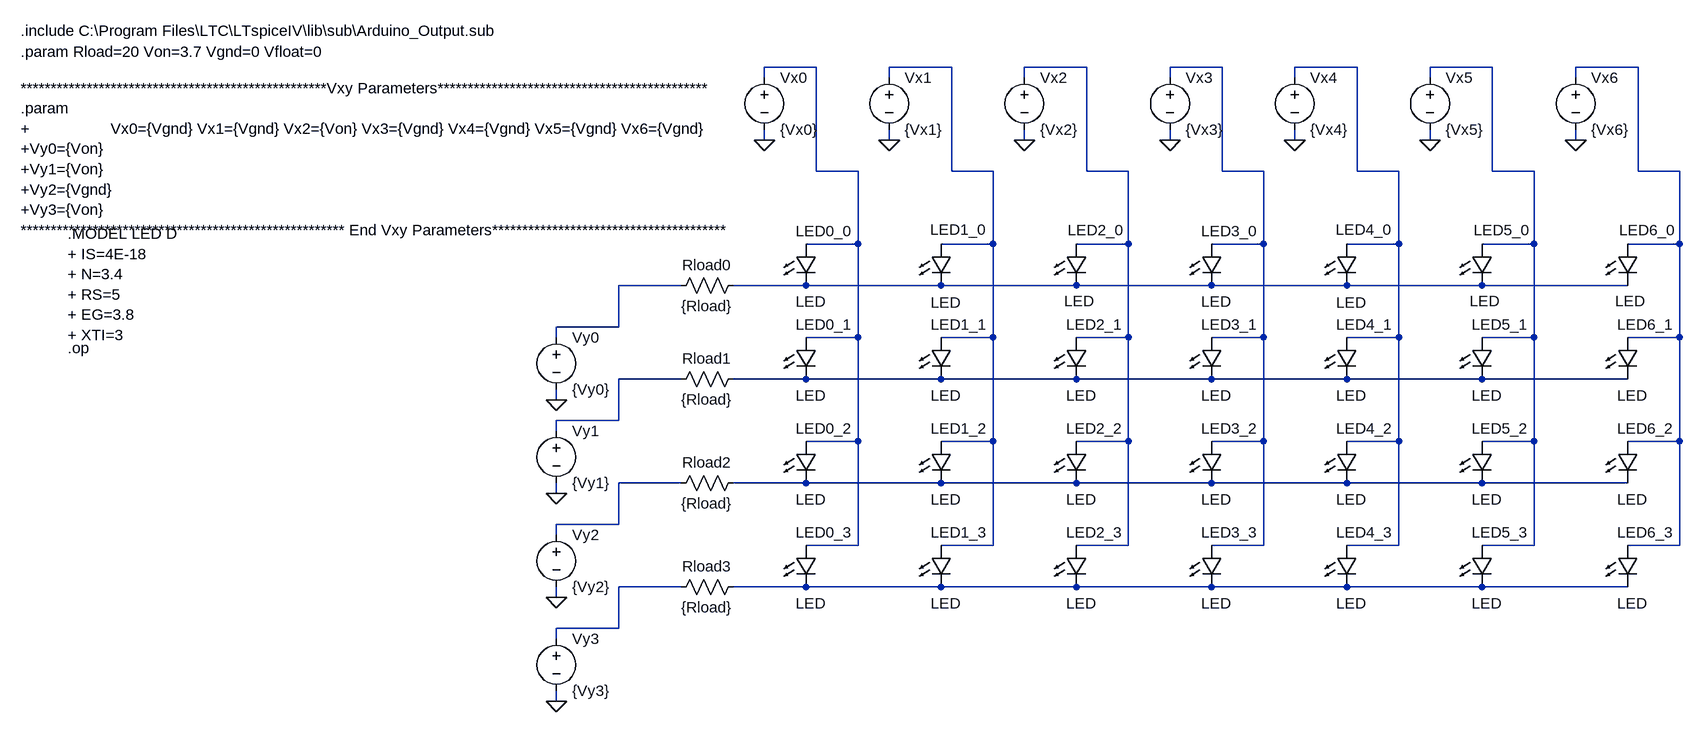
[diagram p0: schematic LED_Array.asc]
LED_Array.asc, the LTspice schematic file:
Version 4
SHEET 1 1512 804
WIRE 176 -192 96 -192
WIRE 384 -192 288 -192
WIRE 592 -192 496 -192
WIRE 800 -192 720 -192
WIRE 1008 -192 912 -192
WIRE 1216 -192 1120 -192
WIRE 1440 -192 1344 -192
WIRE 96 -176 96 -192
WIRE 288 -176 288 -192
WIRE 496 -176 496 -192
WIRE 720 -176 720 -192
WIRE 912 -176 912 -192
WIRE 1120 -176 1120 -192
WIRE 1344 -176 1344 -192
WIRE 96 -80 96 -96
WIRE 288 -80 288 -96
WIRE 496 -80 496 -96
WIRE 720 -80 720 -96
WIRE 912 -80 912 -96
WIRE 1120 -80 1120 -96
WIRE 1344 -80 1344 -96
WIRE 176 -32 176 -192
WIRE 240 -32 176 -32
WIRE 384 -32 384 -192
WIRE 448 -32 384 -32
WIRE 592 -32 592 -192
WIRE 656 -32 592 -32
WIRE 800 -32 800 -192
WIRE 864 -32 800 -32
WIRE 1008 -32 1008 -192
WIRE 1072 -32 1008 -32
WIRE 1216 -32 1216 -192
WIRE 1280 -32 1216 -32
WIRE 1440 -32 1440 -192
WIRE 1504 -32 1440 -32
WIRE 240 80 240 -32
WIRE 240 80 160 80
WIRE 448 80 448 -32
WIRE 448 80 368 80
WIRE 656 80 656 -32
WIRE 656 80 576 80
WIRE 864 80 864 -32
WIRE 864 80 784 80
WIRE 1072 80 1072 -32
WIRE 1072 80 992 80
WIRE 1280 80 1280 -32
WIRE 1280 80 1200 80
WIRE 1504 80 1504 -32
WIRE 1504 80 1424 80
WIRE -32 144 -128 144
WIRE 160 144 48 144
WIRE 368 144 160 144
WIRE 576 144 368 144
WIRE 784 144 576 144
WIRE 992 144 784 144
WIRE 1200 144 992 144
WIRE 1424 144 1200 144
WIRE -128 208 -128 144
WIRE -128 208 -224 208
WIRE -224 224 -224 208
WIRE 240 224 240 80
WIRE 240 224 160 224
WIRE 448 224 448 80
WIRE 448 224 368 224
WIRE 656 224 656 80
WIRE 656 224 576 224
WIRE 864 224 864 80
WIRE 864 224 784 224
WIRE 1072 224 1072 80
WIRE 1072 224 992 224
WIRE 1280 224 1280 80
WIRE 1280 224 1200 224
WIRE 1504 224 1504 80
WIRE 1504 224 1424 224
WIRE -32 288 -128 288
WIRE 160 288 48 288
WIRE 368 288 160 288
WIRE 576 288 368 288
WIRE 784 288 576 288
WIRE 992 288 784 288
WIRE 1200 288 992 288
WIRE 1424 288 1200 288
WIRE -224 320 -224 304
WIRE -128 352 -128 288
WIRE -128 352 -224 352
WIRE -224 368 -224 352
WIRE 240 384 240 224
WIRE 240 384 160 384
WIRE 448 384 448 224
WIRE 448 384 368 384
WIRE 656 384 656 224
WIRE 656 384 576 384
WIRE 864 384 864 224
WIRE 864 384 784 384
WIRE 1072 384 1072 224
WIRE 1072 384 992 384
WIRE 1280 384 1280 224
WIRE 1280 384 1200 384
WIRE 1504 384 1504 224
WIRE 1504 384 1424 384
WIRE -32 448 -128 448
WIRE 160 448 48 448
WIRE 368 448 160 448
WIRE 576 448 368 448
WIRE 784 448 576 448
WIRE 992 448 784 448
WIRE 1200 448 992 448
WIRE 1424 448 1200 448
WIRE -224 464 -224 448
WIRE -128 512 -128 448
WIRE -128 512 -224 512
WIRE -224 528 -224 512
WIRE 240 544 240 384
WIRE 240 544 160 544
WIRE 448 544 448 384
WIRE 448 544 368 544
WIRE 656 544 656 384
WIRE 656 544 576 544
WIRE 864 544 864 384
WIRE 864 544 784 544
WIRE 1072 544 1072 384
WIRE 1072 544 992 544
WIRE 1280 544 1280 384
WIRE 1280 544 1200 544
WIRE 1504 544 1504 384
WIRE 1504 544 1424 544
WIRE -32 608 -128 608
WIRE 160 608 48 608
WIRE 368 608 160 608
WIRE 576 608 368 608
WIRE 784 608 576 608
WIRE 992 608 784 608
WIRE 1200 608 992 608
WIRE 1424 608 1200 608
WIRE -224 624 -224 608
WIRE -128 672 -128 608
WIRE -128 672 -224 672
WIRE -224 688 -224 672
WIRE -224 784 -224 768
FLAG 96 -80 0
FLAG 288 -80 0
FLAG 496 -80 0
FLAG -224 320 0
FLAG -224 464 0
FLAG -224 624 0
FLAG -224 784 0
FLAG 720 -80 0
FLAG 912 -80 0
FLAG 1120 -80 0
FLAG 1344 -80 0
SYMBOL LED 144 80 R0
WINDOW 0 0 -20 Left 2
WINDOW 3 0 89 Left 2
SYMATTR InstName LED0_0
SYMATTR Value LED
SYMBOL res 64 128 R90
WINDOW 0 0 56 VBottom 2
WINDOW 3 32 56 VTop 2
SYMATTR InstName Rload0
SYMATTR Value {Rload}
SYMBOL res 64 272 R90
WINDOW 0 0 56 VBottom 2
WINDOW 3 32 56 VTop 2
SYMATTR InstName Rload1
SYMATTR Value {Rload}
SYMBOL res 64 432 R90
WINDOW 0 0 56 VBottom 2
WINDOW 3 32 56 VTop 2
SYMATTR InstName Rload2
SYMATTR Value {Rload}
SYMBOL voltage 96 -192 R0
WINDOW 123 0 0 Left 2
WINDOW 39 0 0 Left 2
SYMATTR InstName Vx0
SYMATTR Value {Vx0}
SYMBOL voltage 288 -192 R0
WINDOW 123 0 0 Left 2
WINDOW 39 0 0 Left 2
SYMATTR InstName Vx1
SYMATTR Value {Vx1}
SYMBOL voltage 496 -192 R0
WINDOW 123 0 0 Left 2
WINDOW 39 0 0 Left 2
SYMATTR InstName Vx2
SYMATTR Value {Vx2}
SYMBOL voltage -224 208 R0
WINDOW 123 0 0 Left 2
WINDOW 39 0 0 Left 2
SYMATTR InstName Vy0
SYMATTR Value {Vy0}
SYMBOL voltage -224 352 R0
WINDOW 123 0 0 Left 2
WINDOW 39 0 0 Left 2
SYMATTR InstName Vy1
SYMATTR Value {Vy1}
SYMBOL voltage -224 512 R0
WINDOW 123 0 0 Left 2
WINDOW 39 0 0 Left 2
SYMATTR InstName Vy2
SYMATTR Value {Vy2}
SYMBOL LED 352 80 R0
WINDOW 0 -1 -22 Left 2
WINDOW 3 0 90 Left 2
SYMATTR InstName LED1_0
SYMATTR Value LED
SYMBOL LED 560 80 R0
WINDOW 0 3 -21 Left 2
WINDOW 3 -3 88 Left 2
SYMATTR InstName LED2_0
SYMATTR Value LED
SYMBOL LED 144 224 R0
WINDOW 0 0 -20 Left 2
WINDOW 3 0 89 Left 2
SYMATTR InstName LED0_1
SYMATTR Value LED
SYMBOL LED 352 224 R0
WINDOW 0 0 -20 Left 2
WINDOW 3 0 89 Left 2
SYMATTR InstName LED1_1
SYMATTR Value LED
SYMBOL LED 560 224 R0
WINDOW 0 0 -20 Left 2
WINDOW 3 0 89 Left 2
SYMATTR InstName LED2_1
SYMATTR Value LED
SYMBOL LED 144 384 R0
WINDOW 0 0 -20 Left 2
WINDOW 3 0 89 Left 2
SYMATTR InstName LED0_2
SYMATTR Value LED
SYMBOL LED 352 384 R0
WINDOW 0 0 -20 Left 2
WINDOW 3 0 89 Left 2
SYMATTR InstName LED1_2
SYMATTR Value LED
SYMBOL LED 560 384 R0
WINDOW 0 0 -20 Left 2
WINDOW 3 0 89 Left 2
SYMATTR InstName LED2_2
SYMATTR Value LED
SYMBOL voltage -224 672 R0
WINDOW 123 0 0 Left 2
WINDOW 39 0 0 Left 2
SYMATTR InstName Vy3
SYMATTR Value {Vy3}
SYMBOL res 64 592 R90
WINDOW 0 0 56 VBottom 2
WINDOW 3 32 56 VTop 2
SYMATTR InstName Rload3
SYMATTR Value {Rload}
SYMBOL LED 144 544 R0
WINDOW 0 0 -20 Left 2
WINDOW 3 0 89 Left 2
SYMATTR InstName LED0_3
SYMATTR Value LED
SYMBOL LED 352 544 R0
WINDOW 0 0 -20 Left 2
WINDOW 3 0 89 Left 2
SYMATTR InstName LED1_3
SYMATTR Value LED
SYMBOL LED 560 544 R0
WINDOW 0 0 -20 Left 2
WINDOW 3 0 89 Left 2
SYMATTR InstName LED2_3
SYMATTR Value LED
SYMBOL LED 768 80 R0
WINDOW 0 0 -20 Left 2
WINDOW 3 0 89 Left 2
SYMATTR InstName LED3_0
SYMATTR Value LED
SYMBOL voltage 720 -192 R0
WINDOW 123 0 0 Left 2
WINDOW 39 0 0 Left 2
SYMATTR InstName Vx3
SYMATTR Value {Vx3}
SYMBOL voltage 912 -192 R0
WINDOW 123 0 0 Left 2
WINDOW 39 0 0 Left 2
SYMATTR InstName Vx4
SYMATTR Value {Vx4}
SYMBOL voltage 1120 -192 R0
WINDOW 123 0 0 Left 2
WINDOW 39 0 0 Left 2
SYMATTR InstName Vx5
SYMATTR Value {Vx5}
SYMBOL LED 976 80 R0
WINDOW 0 -1 -22 Left 2
WINDOW 3 0 90 Left 2
SYMATTR InstName LED4_0
SYMATTR Value LED
SYMBOL LED 1184 80 R0
WINDOW 0 3 -21 Left 2
WINDOW 3 -3 88 Left 2
SYMATTR InstName LED5_0
SYMATTR Value LED
SYMBOL LED 768 224 R0
WINDOW 0 0 -20 Left 2
WINDOW 3 0 89 Left 2
SYMATTR InstName LED3_1
SYMATTR Value LED
SYMBOL LED 976 224 R0
WINDOW 0 0 -20 Left 2
WINDOW 3 0 89 Left 2
SYMATTR InstName LED4_1
SYMATTR Value LED
SYMBOL LED 1184 224 R0
WINDOW 0 0 -20 Left 2
WINDOW 3 0 89 Left 2
SYMATTR InstName LED5_1
SYMATTR Value LED
SYMBOL LED 768 384 R0
WINDOW 0 0 -20 Left 2
WINDOW 3 0 89 Left 2
SYMATTR InstName LED3_2
SYMATTR Value LED
SYMBOL LED 976 384 R0
WINDOW 0 0 -20 Left 2
WINDOW 3 0 89 Left 2
SYMATTR InstName LED4_2
SYMATTR Value LED
SYMBOL LED 1184 384 R0
WINDOW 0 0 -20 Left 2
WINDOW 3 0 89 Left 2
SYMATTR InstName LED5_2
SYMATTR Value LED
SYMBOL LED 768 544 R0
WINDOW 0 0 -20 Left 2
WINDOW 3 0 89 Left 2
SYMATTR InstName LED3_3
SYMATTR Value LED
SYMBOL LED 976 544 R0
WINDOW 0 0 -20 Left 2
WINDOW 3 0 89 Left 2
SYMATTR InstName LED4_3
SYMATTR Value LED
SYMBOL LED 1184 544 R0
WINDOW 0 0 -20 Left 2
WINDOW 3 0 89 Left 2
SYMATTR InstName LED5_3
SYMATTR Value LED
SYMBOL voltage 1344 -192 R0
WINDOW 123 0 0 Left 2
WINDOW 39 0 0 Left 2
SYMATTR InstName Vx6
SYMATTR Value {Vx6}
SYMBOL LED 1408 80 R0
WINDOW 0 3 -21 Left 2
WINDOW 3 -3 88 Left 2
SYMATTR InstName LED6_0
SYMATTR Value LED
SYMBOL LED 1408 224 R0
WINDOW 0 0 -20 Left 2
WINDOW 3 0 89 Left 2
SYMATTR InstName LED6_1
SYMATTR Value LED
SYMBOL LED 1408 384 R0
WINDOW 0 0 -20 Left 2
WINDOW 3 0 89 Left 2
SYMATTR InstName LED6_2
SYMATTR Value LED
SYMBOL LED 1408 544 R0
WINDOW 0 0 -20 Left 2
WINDOW 3 0 89 Left 2
SYMATTR InstName LED6_3
SYMATTR Value LED
TEXT -1048 -160 Left 2 !***************************************************Vxy Parameters*********************************************\n.param\n+                  Vx0={Vgnd} Vx1={Vgnd} Vx2={Von} Vx3={Vgnd} Vx4={Vgnd} Vx5={Vgnd} Vx6={Vgnd}\n+Vy0={Von}\n+Vy1={Von}\n+Vy2={Vgnd}\n+Vy3={Von}\n****************************************************** End Vxy Parameters***************************************
TEXT -1048 -216 Left 2 !.param Rload=20 Von=3.7 Vgnd=0 Vfloat=0
TEXT -976 240 Left 2 !.op
TEXT -1048 -248 Left 2 !.include C:\\Program Files\\LTC\\LTspiceIV\\lib\\sub\\Arduino_Output.sub
TEXT -976 64 Left 2 !.MODEL LED D\n+ IS=4E-18\n+ N=3.4\n+ RS=5\n+ EG=3.8\n+ XTI=3

The netlist it stands for:
* LED_Array.asc
D§LED0_0 N001 N009 LED
Rload0 N009 N008 {Rload}
Rload1 N011 N010 {Rload}
Rload2 N013 N012 {Rload}
Vx0 N001 0 {Vx0}
Vx1 N002 0 {Vx1}
Vx2 N003 0 {Vx2}
Vy0 N008 0 {Vy0}
Vy1 N010 0 {Vy1}
Vy2 N012 0 {Vy2}
D§LED1_0 N002 N009 LED
D§LED2_0 N003 N009 LED
D§LED0_1 N001 N011 LED
D§LED1_1 N002 N011 LED
D§LED2_1 N003 N011 LED
D§LED0_2 N001 N013 LED
D§LED1_2 N002 N013 LED
D§LED2_2 N003 N013 LED
Vy3 N014 0 {Vy3}
Rload3 N015 N014 {Rload}
D§LED0_3 N001 N015 LED
D§LED1_3 N002 N015 LED
D§LED2_3 N003 N015 LED
D§LED3_0 N004 N009 LED
Vx3 N004 0 {Vx3}
Vx4 N005 0 {Vx4}
Vx5 N006 0 {Vx5}
D§LED4_0 N005 N009 LED
D§LED5_0 N006 N009 LED
D§LED3_1 N004 N011 LED
D§LED4_1 N005 N011 LED
D§LED5_1 N006 N011 LED
D§LED3_2 N004 N013 LED
D§LED4_2 N005 N013 LED
D§LED5_2 N006 N013 LED
D§LED3_3 N004 N015 LED
D§LED4_3 N005 N015 LED
D§LED5_3 N006 N015 LED
Vx6 N007 0 {Vx6}
D§LED6_0 N007 N009 LED
D§LED6_1 N007 N011 LED
D§LED6_2 N007 N013 LED
D§LED6_3 N007 N015 LED
.model D D
.lib standard.dio
***************************************************Vxy Parameters*********************************************
.param
+                  Vx0={Vgnd} Vx1={Vgnd} Vx2={Von} Vx3={Vgnd} Vx4={Vgnd} Vx5={Vgnd} Vx6={Vgnd}
+Vy0={Von}
+Vy1={Von}
+Vy2={Vgnd}
+Vy3={Von}
****************************************************** End Vxy Parameters***************************************
.param Rload=20 Von=3.7 Vgnd=0 Vfloat=0
.op
.include C:\Program Files\LTC\LTspiceIV\lib\sub\Arduino_Output.sub
.MODEL LED D
+ IS=4E-18
+ N=3.4
+ RS=5
+ EG=3.8
+ XTI=3
.backanno
.end